# Altium schematic sheet Test.SchDoc: Test
size A4; SheetNumber: 12; SheetTotal: 13
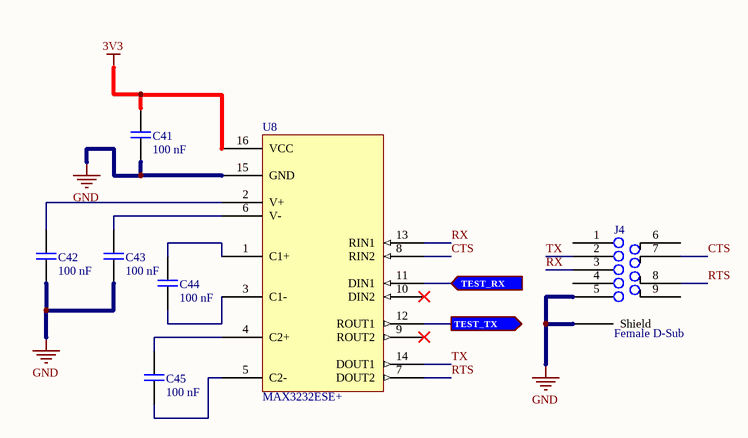
[diagram p0: Test.SchDoc]

## Parts
C41  100 nF  [MergenElektronik_Capacitors_Ceramics_SMDs_0603_M_NS]
C42  100 nF  [MergenElektronik_Capacitors_Ceramics_SMDs_0603_M_NS]
C43  100 nF  [MergenElektronik_Capacitors_Ceramics_SMDs_0603_M_NS]
C44  100 nF  [MergenElektronik_Capacitors_Ceramics_SMDs_0603_M_NS]
C45  100 nF  [MergenElektronik_Capacitors_Ceramics_SMDs_0603_M_NS]
J4  Female D-Sub  [MergenElektronik_Libraries_Connectors_D-Sub_9Position]
U8  MAX3232ESE+  [MergenElektronik_Interfaces_RS232s_SOIC-16]

## Ports
TEST_RX (in, see Microcontroller[4B]), TEST_TX (out, see Microcontroller[3B])

## Nets
3V3: C41.1 U8.16(VCC)
GND: C41.2 C42.2 C43.2 J4.5 J4.Shield U8.15(GND)
CTS: J4.7 U8.8(RIN2)
RTS: J4.8 U8.7(DOUT2)
RX: J4.3 U8.13(RIN1)
TEST_RX: U8.11(DIN1) ; port TEST_RX
TEST_TX: U8.12(ROUT1) ; port TEST_TX
TX: J4.2 U8.14(DOUT1)
NetC42_1: C42.1 U8.2(V+)
NetC43_1: C43.1 U8.6(V-)
NetC44_1: C44.1 U8.1(C1+)
NetC44_2: C44.2 U8.3(C1-)
NetC45_1: C45.1 U8.4(C2+)
NetC45_2: C45.2 U8.5(C2-)

Not connected (* = marked no-connect by the designer): J4 1 4 6 9; U8 9(ROUT2)* 10(DIN2)*

## Notes on the sheet
- Title:
- Size:
- Date:
- A4
- Number:
- Time:
- Revision:
- Sheet
- of
- Project
- Drawn By :

## Library data of the parts
C41-C45 = MergenElektronik_Capacitors_Ceramic_SMDs_100nF_100V: Mergen Elektronik - Capacitors - Ceramics - SMDs - 0603 - 100 nF - 100V; Manufacturer: Samsung Electro-Mechanics; Manufacturer Number: CL10B104KC8NNNC; Model: Ceramic Capacitors; Tolerance: ±10%; Value: 100 nF; Temperature: -55°C up to +125°C; Digi-Key Number: 1276-6807-1-ND; Package: 0603(1608 Metric); Mouser Number: 187-CL10B104KC8NNNC; Mounting Type: Surface Mount; Farnell Number: 3013412; Özdisan Number: CL10B104KC8NNNC; Supplier 1: Digikey; Supplier 2: Mouser; Supplier Part Number 1: 1276-6807-1-ND; Supplier Part Number 2: 187-CL10B104KC8NNNC; Voltage Rating: 100V
J4 = MergenElekttronik_Connectors_D-Sub_Female_9Position: Mergen Elektronik - Connectors - D-Sub - Female 9 Position; Manufacturer: Assmann WSW Components; Manufacturer Number: A-DF 09 A/KG-T2S; Model: D-Sub 9 Position Female Connector; Value: A-DF 09 A/KG-T2S; Number of Postion: 9; Current Rating: 3A; Voltage Rating: 250V; Connector Style: D-Sub; Number of Rows: 2; Connector Type: Female; Temperature: -55°C up to 105°C; Mounting Type: THT; Digi-Key Number: AE10921-ND; Supplier 1: Digi-kEY; Supplier Part Number 1: AE10921-ND
U8 = MergenElektronik_Interfaces_RS232s_MAX3232ESE+: Mergen Elektronik - Interfaces - RS232s - MAX3232ESE+; Manufacturer: Analog Devices Inc./Maxim Integrated; Model: RS232 Interfaces; Protocol: RS232; Operating Supply Voltage: 3V up to 5.5V; Manufacturer Number: MAX3232ESE+; Value: MAX3232ESE+; Mounting Type: Surface Mount; Package: SOIC-16; Temperature: -40°C up to 85°C; Mouser Number: 700-MAX3232ESE; Farnell Number: 2519459; Supplier 1: Digi-Key; Supplier Part Number 1: MAX3232ESE+-ND; Supplier 2: Mouser; Supplier Part Number 2: 700-MAX3232ESE; Digi-Key Number: MAX3232ESE+-ND